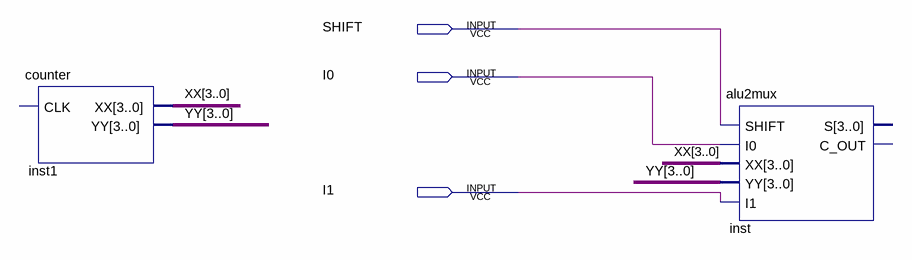
[diagram p0: schematic sheet]
// Quartus schematic counterfinal.bdf as structural Verilog: 2 symbols, 3 pins
module counterfinal (
  input  SHIFT,
  input  I0,
  input  I1
);

  wire [3:0] XX, YY;

  counter inst1 (.XX(XX), .YY(YY));  // open: CLK
  alu2mux inst (.SHIFT(SHIFT), .I0(I0), .XX(XX), .YY(YY), .I1(I1));  // open: S, C_OUT
endmodule
